# Altium project Nixie_Motherboard.PrjPcb
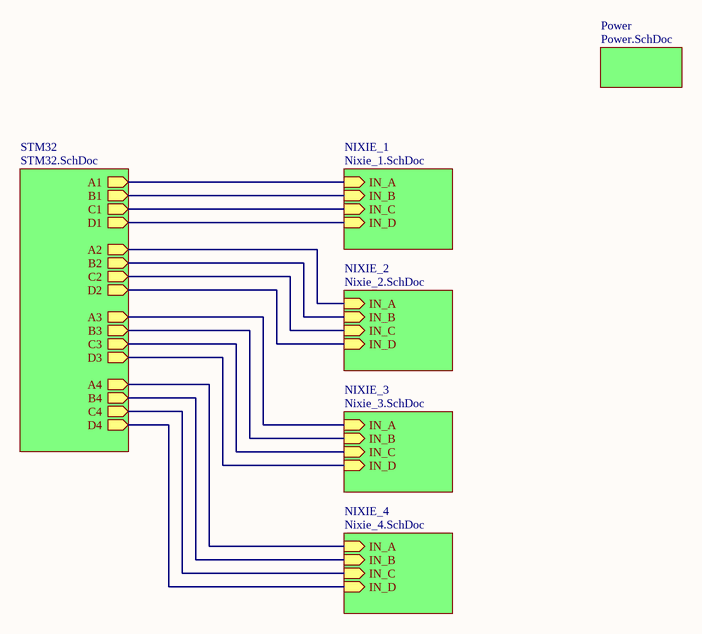
[diagram p0: Motherboard.SchDoc]
7 sheets, 74 parts. Net scope: hierarchical (ports join the sheet entries above them; power ports are global).
Board file: MotherBoard.PcbDoc
Sheets:
  Motherboard.SchDoc
    NIXIE_1 = Nixie_1.SchDoc
    NIXIE_2 = Nixie_2.SchDoc
    NIXIE_3 = Nixie_3.SchDoc
    NIXIE_4 = Nixie_4.SchDoc
    STM32 = STM32.SchDoc
    Power = Power.SchDoc

## Sheet Motherboard.SchDoc
size A4; SheetNumber: 1; SheetTotal: 7

### Sub-sheets
NIXIE_1 = Nixie_1.SchDoc: IN_A (in), IN_B (in), IN_C (in), IN_D (in)
NIXIE_2 = Nixie_2.SchDoc: IN_A (in), IN_B (in), IN_C (in), IN_D (in)
NIXIE_3 = Nixie_3.SchDoc: IN_A (in), IN_B (in), IN_C (in), IN_D (in)
NIXIE_4 = Nixie_4.SchDoc: IN_A (in), IN_B (in), IN_C (in), IN_D (in)
Power = Power.SchDoc: no entries
STM32 = STM32.SchDoc: A1 (out), B1 (out), C1 (out), D1 (out), A2 (out), B2 (out), C2 (out), D2 (out), A3 (out), B3 (out), C3 (out), D3 (out), A4 (out), B4 (out), C4 (out), D4 (out)

### Nets
NetQ1_1: sheet NIXIE_1/IN_A, sheet STM32/A1
NetQ1_4: sheet NIXIE_1/IN_B, sheet STM32/B1
NetQ2_1: sheet NIXIE_1/IN_C, sheet STM32/C1
NetQ2_4: sheet NIXIE_1/IN_D, sheet STM32/D1
NetQ3_1: sheet NIXIE_2/IN_A, sheet STM32/A2
NetQ3_4: sheet NIXIE_2/IN_B, sheet STM32/B2
NetQ4_1: sheet NIXIE_2/IN_C, sheet STM32/C2
NetQ4_4: sheet NIXIE_2/IN_D, sheet STM32/D2
NetQ5_1: sheet NIXIE_3/IN_A, sheet STM32/A3
NetQ5_4: sheet NIXIE_3/IN_B, sheet STM32/B3
NetQ6_1: sheet NIXIE_3/IN_C, sheet STM32/C3
NetQ6_4: sheet NIXIE_3/IN_D, sheet STM32/D3
NetQ7_1: sheet NIXIE_4/IN_A, sheet STM32/A4
NetQ7_4: sheet NIXIE_4/IN_B, sheet STM32/B4
NetQ8_1: sheet NIXIE_4/IN_C, sheet STM32/C4
NetQ8_4: sheet NIXIE_4/IN_D, sheet STM32/D4

## Sheet Nixie_1.SchDoc
size A4; SheetNumber: 4; SheetTotal: 7
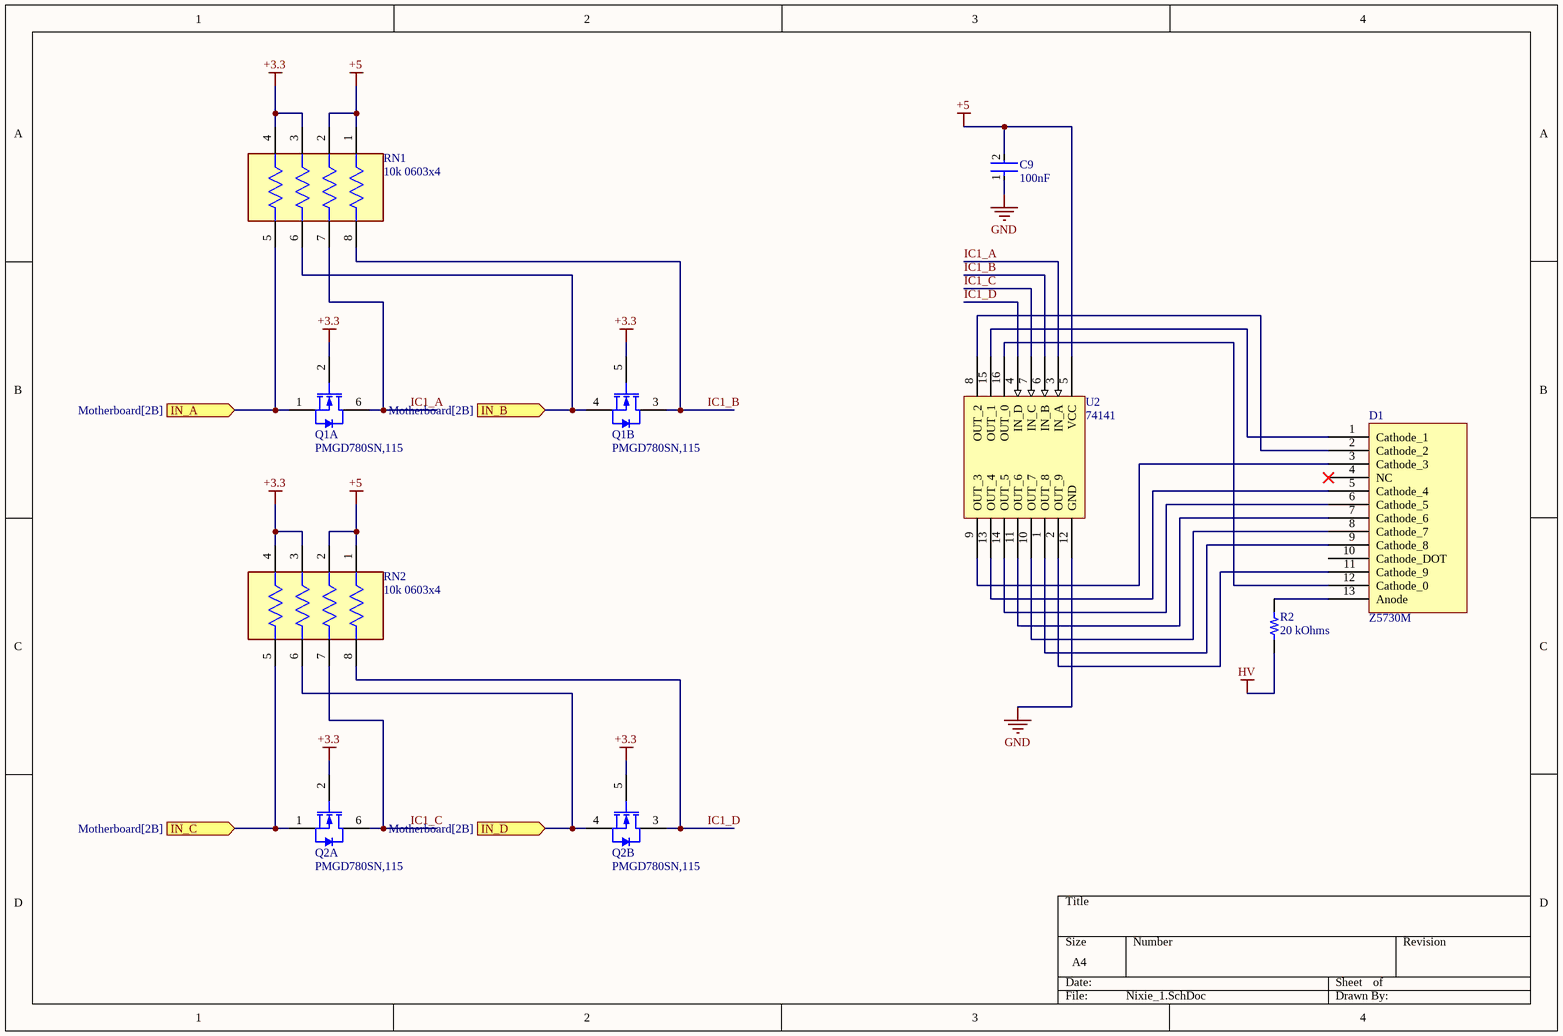
[diagram p1: Nixie_1.SchDoc]

### Parts
C9  100nF  [FP-C1005-050-0_15-MFG]
D1  Z5730M  [Z5730M]
Q1  PMGD780SN,115  [NXP-SOT363_N]  (parts A,B of 2)
Q2  PMGD780SN,115  [NXP-SOT363_N]  (parts A,B of 2)
R2  20 kOhms  [RES 1210_3225]
RN1  10k 0603x4  [FP-EXB38V-MFG]
RN2  10k 0603x4  [FP-EXB38V-MFG]
U2  74141  [DIP-16]

### Ports
IN_A (in, see Motherboard[2B]), IN_B (in, see Motherboard[2B]), IN_C (in, see Motherboard[2B]), IN_D (in, see Motherboard[2B])

### Nets
+3.3: Q1.2(G1) Q1.5(G2) Q2.2(G1) Q2.5(G2) RN1.3 RN1.4 RN2.3 RN2.4
+5: C9.2 RN1.1 RN1.2 RN2.1 RN2.2 U2.5(VCC)
GND: C9.1 U2.12(GND)
HV: R2.1
IC1_A: Q1.6(D1) RN1.7 U2.3(IN_A)
IC1_B: Q1.3(D2) RN1.8 U2.6(IN_B)
IC1_C: Q2.6(D1) RN2.7 U2.7(IN_C)
IC1_D: Q2.3(D2) RN2.8 U2.4(IN_D)
NetD1_1: D1.1(Cathode_1) U2.15(OUT_1)
NetD1_2: D1.2(Cathode_2) U2.8(OUT_2)
NetD1_3: D1.3(Cathode_3) U2.9(OUT_3)
NetD1_5: D1.5(Cathode_4) U2.13(OUT_4)
NetD1_6: D1.6(Cathode_5) U2.14(OUT_5)
NetD1_7: D1.7(Cathode_6) U2.11(OUT_6)
NetD1_8: D1.8(Cathode_7) U2.10(OUT_7)
NetD1_9: D1.9(Cathode_8) U2.1(OUT_8)
NetD1_11: D1.11(Cathode_9) U2.2(OUT_9)
NetD1_12: D1.12(Cathode_0) U2.16(OUT_0)
NetD1_13: D1.13(Anode) R2.2
NetQ1_1: Q1.1(S1) RN1.5 ; port IN_A
NetQ1_4: Q1.4(S2) RN1.6 ; port IN_B
NetQ2_1: Q2.1(S1) RN2.5 ; port IN_C
NetQ2_4: Q2.4(S2) RN2.6 ; port IN_D

Not connected (* = marked no-connect by the designer): D1 4(NC)* 10(Cathode_DOT)

### Library data of the parts
C9 = CMP-2000-05438-2: CAP CER 100nF 10V X5R 0402; Dielectric Material: Ceramic; Tolerance: 20%; Capacitance: 4.7uF
Q1 Q2 = CMP-1258-00177-1: Dual N-Channel uTrenchMOS Standard Level FET, 60 V, 0.49 A, 6-Pin SOT363, Tape and Reel; Manufacturer: NXP Semiconductors; ID [max] (A): 0.49; Packing: Tape & Reel; Channel Type: N; Coss [typ] (pF): 5; VDS [max] (V): 60; VGSth [typ] (V): 2; Ciss [typ] (pF): 23
R2 = CRCW121020K0FKEAHP: RES SMD 20K OHM 1% 3/4W 1210; Manufacturer: Vishay Dale; Power (Watts): 0.75W, 3/4W; Temperature Coefficient: ±100ppm/°C
RN1 RN2 = CMP-2000-05314-2: RES ARRAY 4 RES 10K OHM 1206 / RC-ML08W103JT; Number of Terminals/Pins: 8; Number of Elements: 4; Tolerance: 5%; Resistance: 10kR; Temperature Coefficient: 200ppm/°C; Power Per Element: 62.5mW; Voltage Rating (DC): 100V; Circuit Type: Isolated; Power Dissipation: 63mW; Voltage Rating: 50V

## Sheet Nixie_2.SchDoc
size A4; SheetNumber: 5; SheetTotal: 7
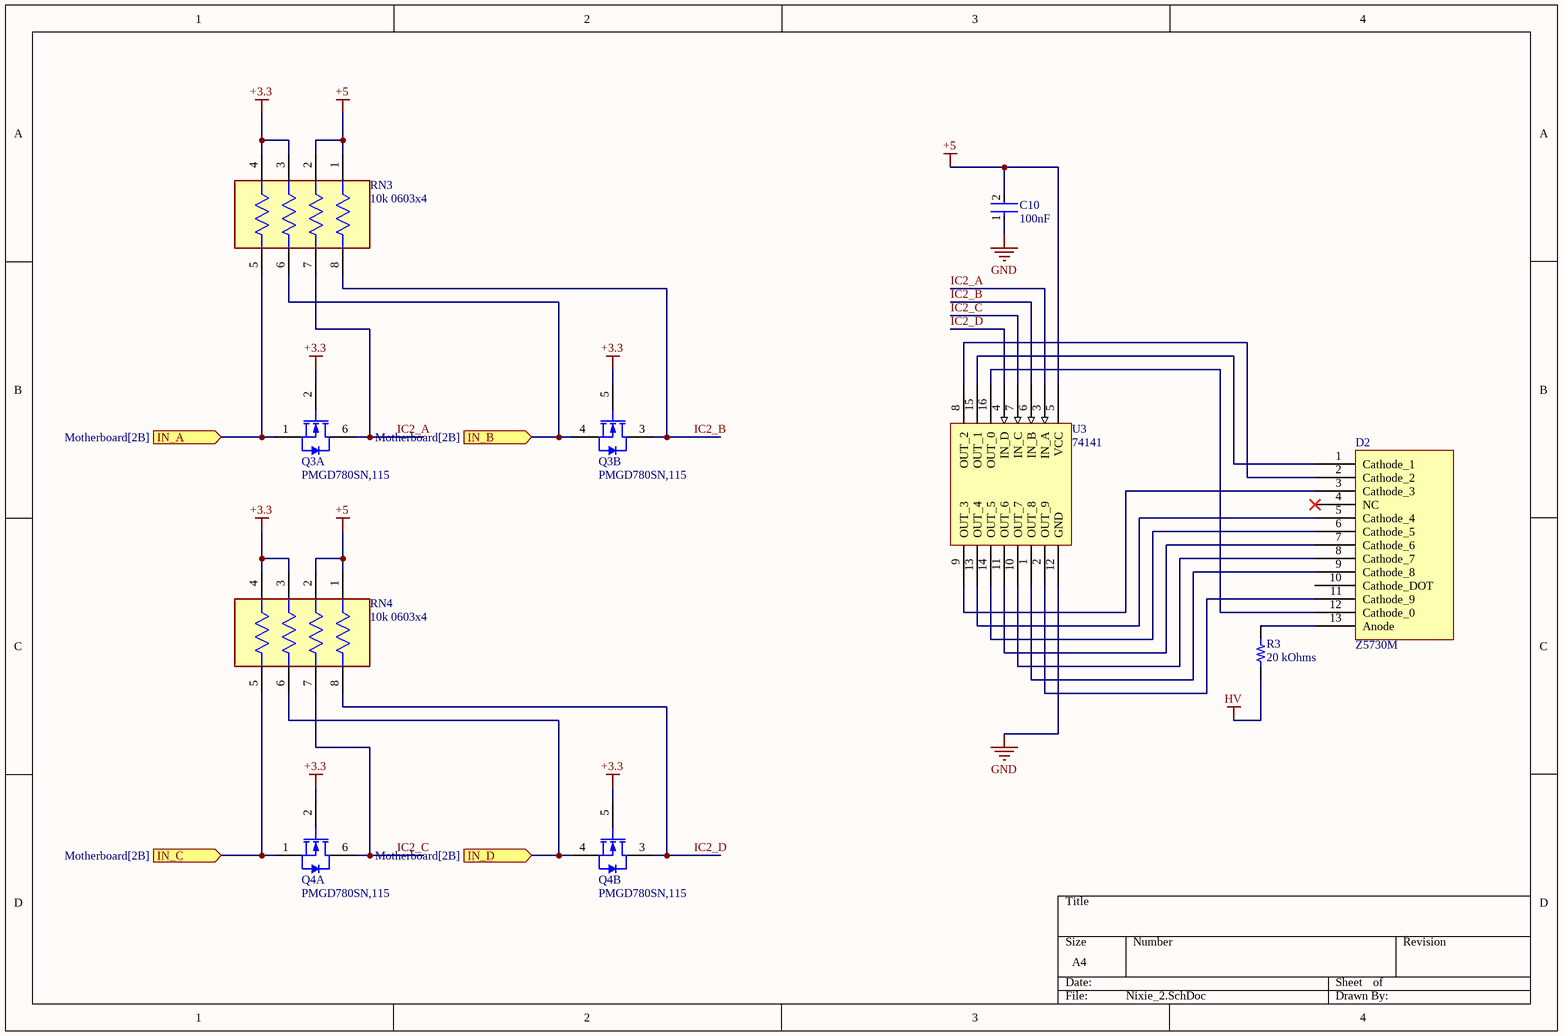
[diagram p2: Nixie_2.SchDoc]

### Parts
C10  100nF  [FP-C1005-050-0_15-MFG]
D2  Z5730M  [Z5730M]
Q3  PMGD780SN,115  [NXP-SOT363_N]  (parts A,B of 2)
Q4  PMGD780SN,115  [NXP-SOT363_N]  (parts A,B of 2)
R3  20 kOhms  [RES 1210_3225]
RN3  10k 0603x4  [FP-EXB38V-MFG]
RN4  10k 0603x4  [FP-EXB38V-MFG]
U3  74141  [DIP-16]

### Ports
IN_A (in, see Motherboard[2B]), IN_B (in, see Motherboard[2B]), IN_C (in, see Motherboard[2B]), IN_D (in, see Motherboard[2B])

### Nets
+3.3: Q3.2(G1) Q3.5(G2) Q4.2(G1) Q4.5(G2) RN3.3 RN3.4 RN4.3 RN4.4
+5: C10.2 RN3.1 RN3.2 RN4.1 RN4.2 U3.5(VCC)
GND: C10.1 U3.12(GND)
HV: R3.1
IC2_A: Q3.6(D1) RN3.7 U3.3(IN_A)
IC2_B: Q3.3(D2) RN3.8 U3.6(IN_B)
IC2_C: Q4.6(D1) RN4.7 U3.7(IN_C)
IC2_D: Q4.3(D2) RN4.8 U3.4(IN_D)
NetD2_1: D2.1(Cathode_1) U3.15(OUT_1)
NetD2_2: D2.2(Cathode_2) U3.8(OUT_2)
NetD2_3: D2.3(Cathode_3) U3.9(OUT_3)
NetD2_5: D2.5(Cathode_4) U3.13(OUT_4)
NetD2_6: D2.6(Cathode_5) U3.14(OUT_5)
NetD2_7: D2.7(Cathode_6) U3.11(OUT_6)
NetD2_8: D2.8(Cathode_7) U3.10(OUT_7)
NetD2_9: D2.9(Cathode_8) U3.1(OUT_8)
NetD2_11: D2.11(Cathode_9) U3.2(OUT_9)
NetD2_12: D2.12(Cathode_0) U3.16(OUT_0)
NetD2_13: D2.13(Anode) R3.2
NetQ3_1: Q3.1(S1) RN3.5 ; port IN_A
NetQ3_4: Q3.4(S2) RN3.6 ; port IN_B
NetQ4_1: Q4.1(S1) RN4.5 ; port IN_C
NetQ4_4: Q4.4(S2) RN4.6 ; port IN_D

Not connected (* = marked no-connect by the designer): D2 4(NC)* 10(Cathode_DOT)

### Library data of the parts
C10 = CMP-2000-05438-2: as C9 on sheet Nixie_1
Q3 Q4 = CMP-1258-00177-1: as Q1 on sheet Nixie_1
R3 = CRCW121020K0FKEAHP: as R2 on sheet Nixie_1
RN3 RN4 = CMP-2000-05314-2: as RN1 on sheet Nixie_1

## Sheet Nixie_3.SchDoc
size A4; SheetNumber: 6; SheetTotal: 7
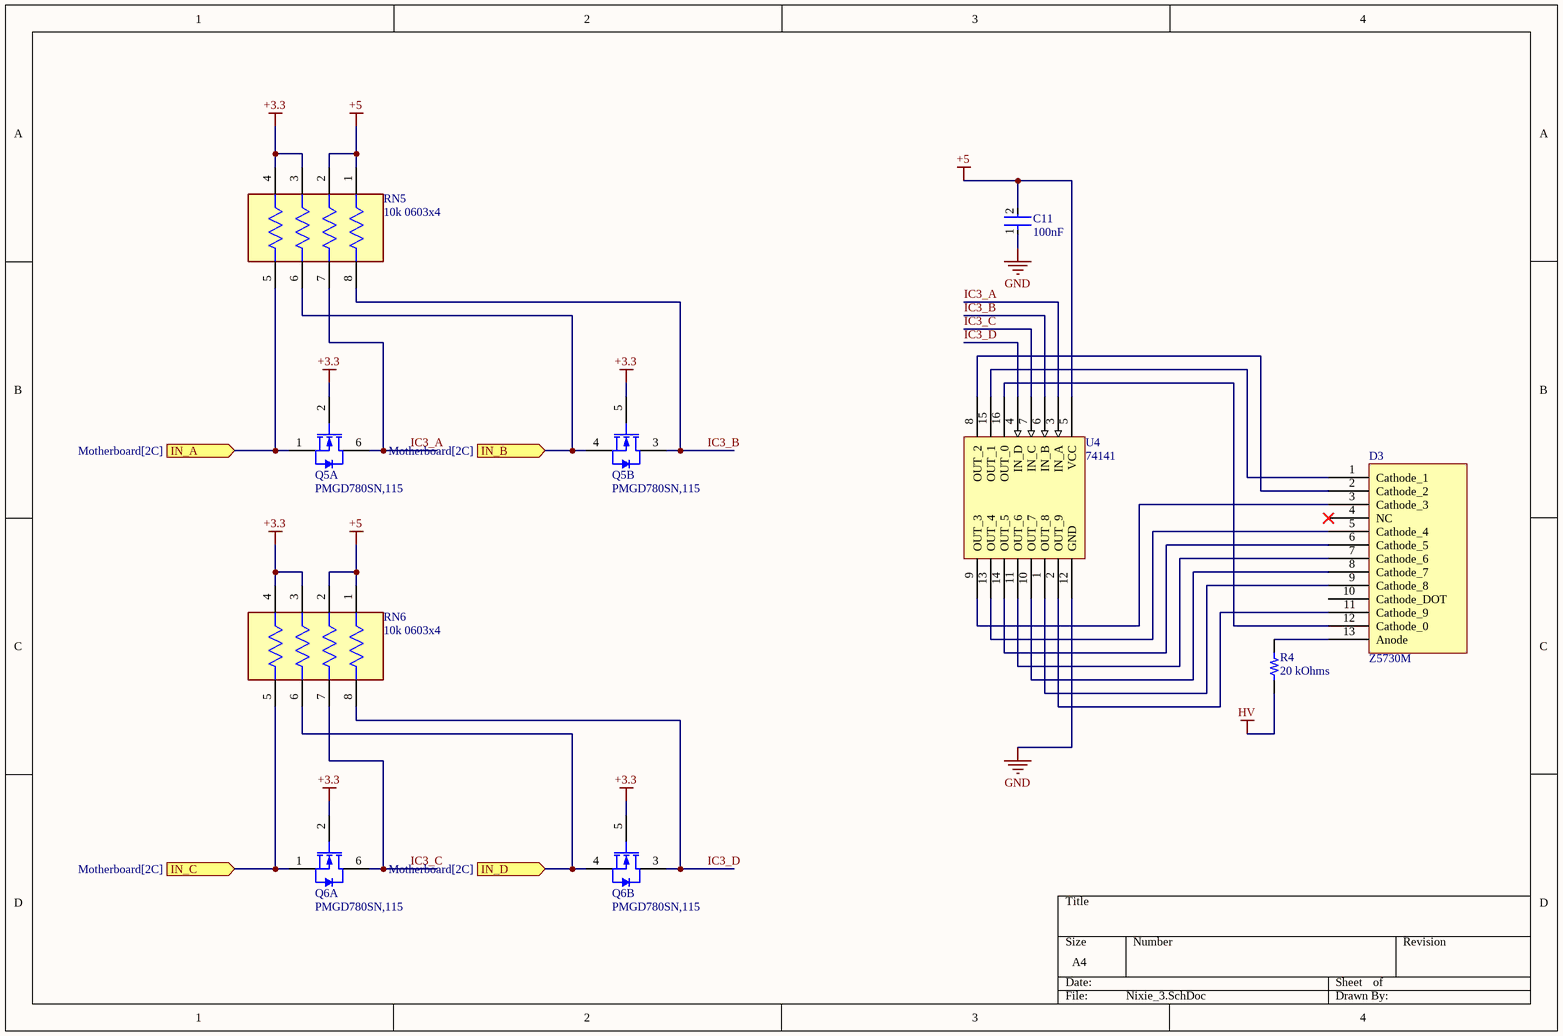
[diagram p3: Nixie_3.SchDoc]

### Parts
C11  100nF  [FP-C1005-050-0_15-MFG]
D3  Z5730M  [Z5730M]
Q5  PMGD780SN,115  [NXP-SOT363_N]  (parts A,B of 2)
Q6  PMGD780SN,115  [NXP-SOT363_N]  (parts A,B of 2)
R4  20 kOhms  [RES 1210_3225]
RN5  10k 0603x4  [FP-EXB38V-MFG]
RN6  10k 0603x4  [FP-EXB38V-MFG]
U4  74141  [DIP-16]

### Ports
IN_A (in, see Motherboard[2C]), IN_B (in, see Motherboard[2C]), IN_C (in, see Motherboard[2C]), IN_D (in, see Motherboard[2C])

### Nets
+3.3: Q5.2(G1) Q5.5(G2) Q6.2(G1) Q6.5(G2) RN5.3 RN5.4 RN6.3 RN6.4
+5: C11.2 RN5.1 RN5.2 RN6.1 RN6.2 U4.5(VCC)
GND: C11.1 U4.12(GND)
HV: R4.1
IC3_A: Q5.6(D1) RN5.7 U4.3(IN_A)
IC3_B: Q5.3(D2) RN5.8 U4.6(IN_B)
IC3_C: Q6.6(D1) RN6.7 U4.7(IN_C)
IC3_D: Q6.3(D2) RN6.8 U4.4(IN_D)
NetD3_1: D3.1(Cathode_1) U4.15(OUT_1)
NetD3_2: D3.2(Cathode_2) U4.8(OUT_2)
NetD3_3: D3.3(Cathode_3) U4.9(OUT_3)
NetD3_5: D3.5(Cathode_4) U4.13(OUT_4)
NetD3_6: D3.6(Cathode_5) U4.14(OUT_5)
NetD3_7: D3.7(Cathode_6) U4.11(OUT_6)
NetD3_8: D3.8(Cathode_7) U4.10(OUT_7)
NetD3_9: D3.9(Cathode_8) U4.1(OUT_8)
NetD3_11: D3.11(Cathode_9) U4.2(OUT_9)
NetD3_12: D3.12(Cathode_0) U4.16(OUT_0)
NetD3_13: D3.13(Anode) R4.2
NetQ5_1: Q5.1(S1) RN5.5 ; port IN_A
NetQ5_4: Q5.4(S2) RN5.6 ; port IN_B
NetQ6_1: Q6.1(S1) RN6.5 ; port IN_C
NetQ6_4: Q6.4(S2) RN6.6 ; port IN_D

Not connected (* = marked no-connect by the designer): D3 4(NC)* 10(Cathode_DOT)

### Library data of the parts
C11 = CMP-2000-05438-2: as C9 on sheet Nixie_1
Q5 Q6 = CMP-1258-00177-1: as Q1 on sheet Nixie_1
R4 = CRCW121020K0FKEAHP: as R2 on sheet Nixie_1
RN5 RN6 = CMP-2000-05314-2: as RN1 on sheet Nixie_1

## Sheet Nixie_4.SchDoc
size A4; SheetNumber: 7; SheetTotal: 7
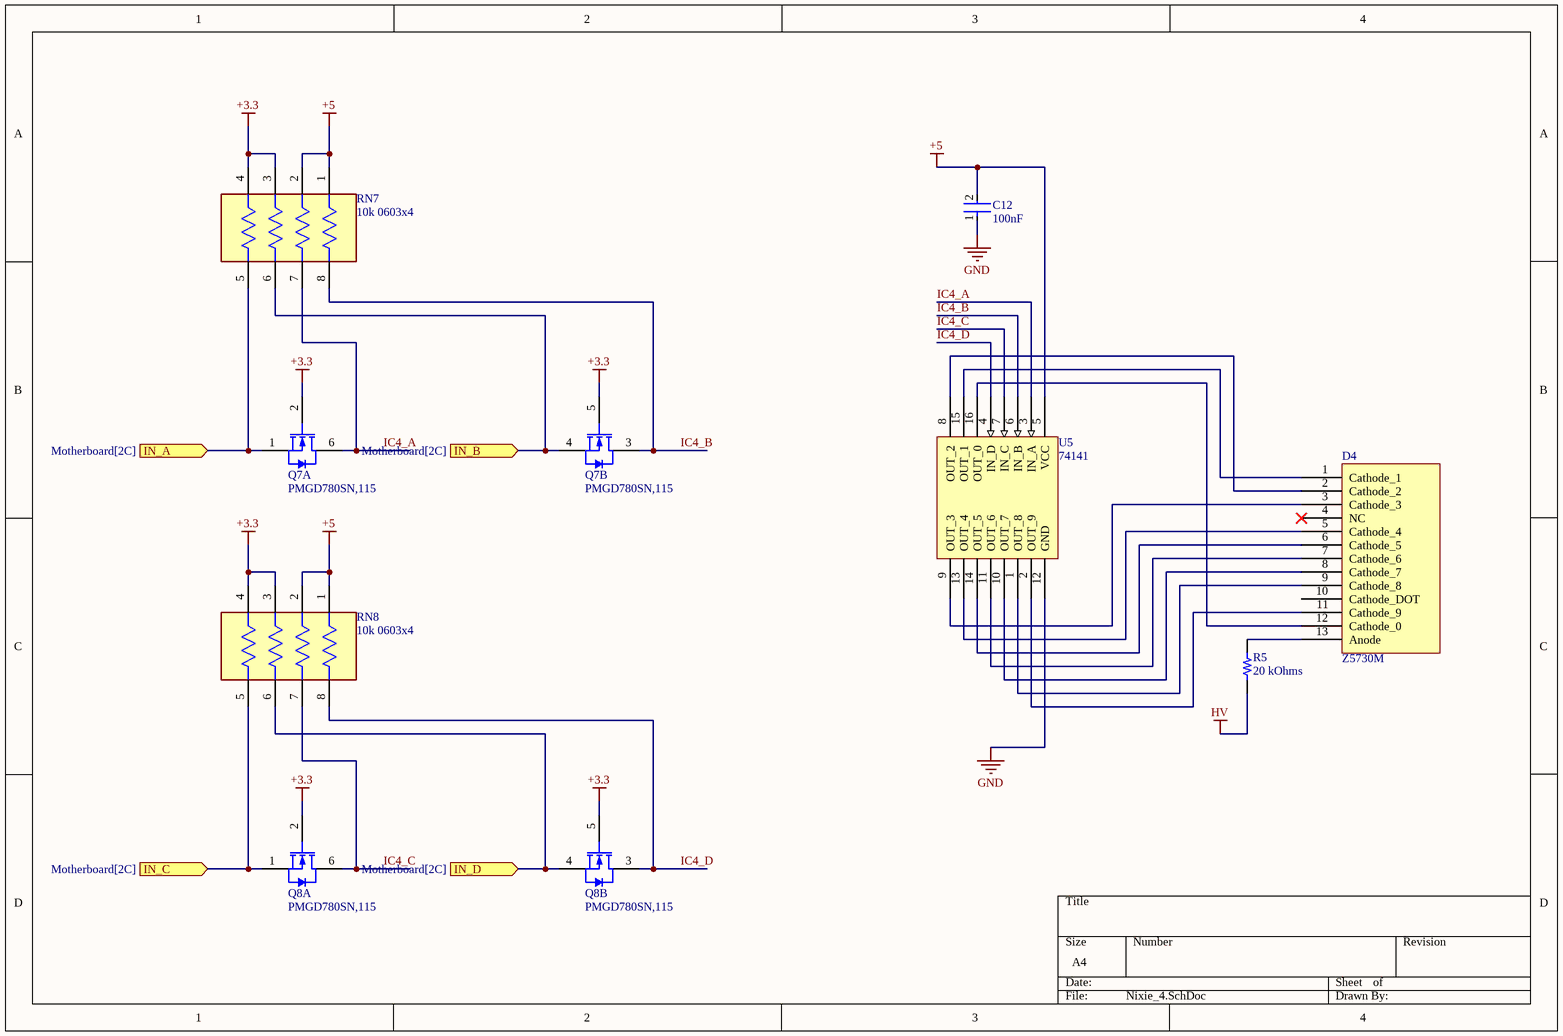
[diagram p4: Nixie_4.SchDoc]

### Parts
C12  100nF  [FP-C1005-050-0_15-MFG]
D4  Z5730M  [Z5730M]
Q7  PMGD780SN,115  [NXP-SOT363_N]  (parts A,B of 2)
Q8  PMGD780SN,115  [NXP-SOT363_N]  (parts A,B of 2)
R5  20 kOhms  [RES 1210_3225]
RN7  10k 0603x4  [FP-EXB38V-MFG]
RN8  10k 0603x4  [FP-EXB38V-MFG]
U5  74141  [DIP-16]

### Ports
IN_A (in, see Motherboard[2C]), IN_B (in, see Motherboard[2C]), IN_C (in, see Motherboard[2C]), IN_D (in, see Motherboard[2C])

### Nets
+3.3: Q7.2(G1) Q7.5(G2) Q8.2(G1) Q8.5(G2) RN7.3 RN7.4 RN8.3 RN8.4
+5: C12.2 RN7.1 RN7.2 RN8.1 RN8.2 U5.5(VCC)
GND: C12.1 U5.12(GND)
HV: R5.1
IC4_A: Q7.6(D1) RN7.7 U5.3(IN_A)
IC4_B: Q7.3(D2) RN7.8 U5.6(IN_B)
IC4_C: Q8.6(D1) RN8.7 U5.7(IN_C)
IC4_D: Q8.3(D2) RN8.8 U5.4(IN_D)
NetD4_1: D4.1(Cathode_1) U5.15(OUT_1)
NetD4_2: D4.2(Cathode_2) U5.8(OUT_2)
NetD4_3: D4.3(Cathode_3) U5.9(OUT_3)
NetD4_5: D4.5(Cathode_4) U5.13(OUT_4)
NetD4_6: D4.6(Cathode_5) U5.14(OUT_5)
NetD4_7: D4.7(Cathode_6) U5.11(OUT_6)
NetD4_8: D4.8(Cathode_7) U5.10(OUT_7)
NetD4_9: D4.9(Cathode_8) U5.1(OUT_8)
NetD4_11: D4.11(Cathode_9) U5.2(OUT_9)
NetD4_12: D4.12(Cathode_0) U5.16(OUT_0)
NetD4_13: D4.13(Anode) R5.2
NetQ7_1: Q7.1(S1) RN7.5 ; port IN_A
NetQ7_4: Q7.4(S2) RN7.6 ; port IN_B
NetQ8_1: Q8.1(S1) RN8.5 ; port IN_C
NetQ8_4: Q8.4(S2) RN8.6 ; port IN_D

Not connected (* = marked no-connect by the designer): D4 4(NC)* 10(Cathode_DOT)

### Library data of the parts
C12 = CMP-2000-05438-2: as C9 on sheet Nixie_1
Q7 Q8 = CMP-1258-00177-1: as Q1 on sheet Nixie_1
R5 = CRCW121020K0FKEAHP: as R2 on sheet Nixie_1
RN7 RN8 = CMP-2000-05314-2: as RN1 on sheet Nixie_1

## Sheet STM32.SchDoc
size A4; SheetNumber: 2; SheetTotal: 7
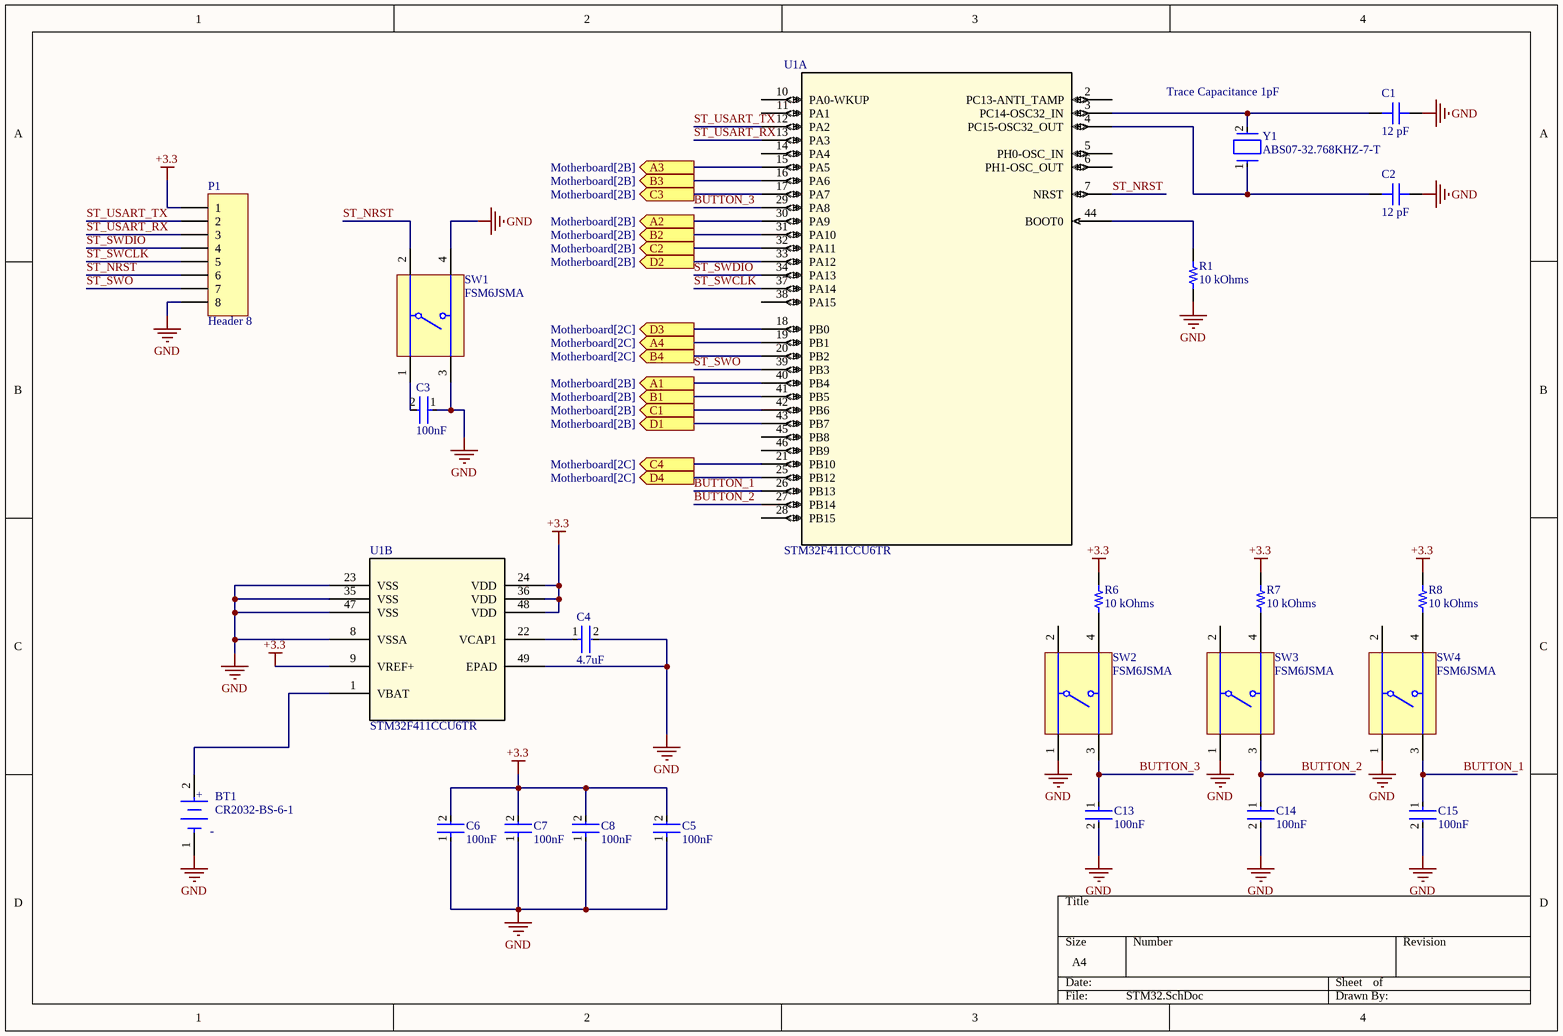
[diagram p5: STM32.SchDoc]

### Parts
BT1  CR2032-BS-6-1  [FP-BU2032SM-BT-GTR-MFG]
C1  12 pF  [CAP 0201_0603]
C2  12 pF  [CAP 0201_0603]
C3  100nF  [FP-C1005-050-0_15-MFG]
C4  4.7uF  [FP-C1005-050-0_15-MFG]
C5  100nF  [FP-C1005-050-0_15-MFG]
C6  100nF  [FP-C1005-050-0_15-MFG]
C7  100nF  [FP-C1005-050-0_15-MFG]
C8  100nF  [FP-C1005-050-0_15-MFG]
C13  100nF  [FP-C1005-050-0_15-MFG]
C14  100nF  [FP-C1005-050-0_15-MFG]
C15  100nF  [FP-C1005-050-0_15-MFG]
P1  Header 8  [HDR1X8]
R1  10 kOhms  [RES 0402_1005]
R6  10 kOhms  [RES 0402_1005]
R7  10 kOhms  [RES 0402_1005]
R8  10 kOhms  [RES 0402_1005]
SW1  FSM6JSMA  [TECO-FSM6JSMA_V]
SW2  FSM6JSMA  [TECO-FSM6JSMA_V]
SW3  FSM6JSMA  [TECO-FSM6JSMA_V]
SW4  FSM6JSMA  [TECO-FSM6JSMA_V]
U1  STM32F411CCU6TR  [UFQFPN-48_7X7X0P55MM]  (parts A,B of 2)
Y1  ABS07-32.768KHZ-7-T  [FP-ABS07-MFG]

### Ports
A1 (out, see Motherboard[2B]), A2 (out, see Motherboard[2B]), A3 (out, see Motherboard[2B]), A4 (out, see Motherboard[2C]), B1 (out, see Motherboard[2B]), B2 (out, see Motherboard[2B]), B3 (out, see Motherboard[2B]), B4 (out, see Motherboard[2C]), C1 (out, see Motherboard[2B]), C2 (out, see Motherboard[2B]), C3 (out, see Motherboard[2B]), C4 (out, see Motherboard[2C]), D1 (out, see Motherboard[2B]), D2 (out, see Motherboard[2B]), D3 (out, see Motherboard[2C]), D4 (out, see Motherboard[2C])

### Nets
+3.3: C5.2 C6.2 C7.2 C8.2 P1.1 R6.2 R7.2 R8.2 U1.9(VREF+) U1.24(VDD) U1.36(VDD) U1.48(VDD)
GND: BT1.1(C) C1.2 C2.2 C3.1 C4.2 C5.1 C6.1 C7.1 C8.1 C13.2 C14.2 C15.2 P1.8 R1.1 SW1.3 SW1.4 SW2.1 SW3.1 SW4.1 U1.8(VSSA) U1.23(VSS) U1.35(VSS) U1.47(VSS) U1.49(EPAD)
BUTTON_1: C15.1 SW4.3 U1.26(PB13)
BUTTON_2: C14.1 SW3.3 U1.27(PB14)
BUTTON_3: C13.1 SW2.3 U1.29(PA8)
ST_NRST: P1.6 SW1.2 U1.7(NRST)
ST_SWCLK: P1.5 U1.37(PA14)
ST_SWDIO: P1.4 U1.34(PA13)
ST_SWO: P1.7 U1.39(PB3)
ST_USART_RX: P1.3 U1.13(PA3)
ST_USART_TX: P1.2 U1.12(PA2)
NetBT1_2: BT1.2(A) U1.1(VBAT)
NetC1_1: C1.1 U1.3(PC14-OSC32_IN) Y1.2
NetC2_1: C2.1 U1.4(PC15-OSC32_OUT) Y1.1
NetC3_2: C3.2 SW1.1
NetC4_1: C4.1 U1.22(VCAP1)
NetQ1_1: U1.40(PB4) ; port A1
NetQ1_4: U1.41(PB5) ; port B1
NetQ2_1: U1.42(PB6) ; port C1
NetQ2_4: U1.43(PB7) ; port D1
NetQ3_1: U1.30(PA9) ; port A2
NetQ3_4: U1.31(PA10) ; port B2
NetQ4_1: U1.32(PA11) ; port C2
NetQ4_4: U1.33(PA12) ; port D2
NetQ5_1: U1.15(PA5) ; port A3
NetQ5_4: U1.16(PA6) ; port B3
NetQ6_1: U1.17(PA7) ; port C3
NetQ6_4: U1.18(PB0) ; port D3
NetQ7_1: U1.19(PB1) ; port A4
NetQ7_4: U1.20(PB2) ; port B4
NetQ8_1: U1.21(PB10) ; port C4
NetQ8_4: U1.25(PB12) ; port D4
NetR1_2: R1.2 U1.44(BOOT0)
NetR6_1: R6.1 SW2.4
NetR7_1: R7.1 SW3.4
NetR8_1: R8.1 SW4.4

Not connected (* = marked no-connect by the designer): SW2 2; SW3 2; SW4 2; U1 2(PC13-ANTI_TAMP) 5(PH0-OSC_IN) 6(PH1-OSC_OUT) 10(PA0-WKUP) 11(PA1) 14(PA4) 28(PB15) 38(PA15) 45(PB8) 46(PB9)

### Notes on the sheet
- (near Y1) Trace Capacitance 1pF
- (in symbol CMP-136216-000002-1) +; -

### Library data of the parts
BT1 = CMP-136216-000002-1: Number of Cells: 1; Termination: SMD/SMT; Mount: Surface Mount; Max Operating Temperature: 280°C; Min Operating Temperature: -40°C; Package Quantity: 400; Case/Package: SMD/SMT
C1 C2 = C0201C100J3GAC7867: CAP CER 10PF 25V C0G/NP0 0201; manufacturer: KEMET; Temperature Coefficient: C0G, NP0; Tolerance: ±5%; Part Number: C0201C100J3GAC7867; Value: 12 pF; Applications: General Purpose; Capacitance: 12 pF; componentlink1description: Datasheet; componentlink1url: https://api.kemet.com/component-edge/download/datasheet/C0201C100J3GAC7867.pdf; componentlink2description: DigiKey Link; componentlink2url: https://www.digikey.com/en/products/detail/kemet/C0201C100J3GAC7867/7381972; Device Package: 0201 (0603 Metric); Features: Low ESL; lastupdated: 13.03.2023 19:01:22; Lifecycle Status: Active; Minimum Order: 1; Mounting Type: Surface Mount, MLCC; Operating Temperature: -55°C ~ 125°C; Package / Case: 0201 (0603 Metric); packaging: TapeAndReel; partid: 4; Part Status: Active; price: 0.02; series: SMD Comm C0G; Size / Dimension: 0.024" L x 0.012" W (0.60mm x 0.30mm); Supplier 1: DigiKey; Supplier Part Number 1: 399-14856-1-ND; Thickness (Max): 0.013" (0.33mm); Voltage - Rated: 25V
C3 C5-C8 C13-C15 = CMP-2000-05438-2: as C9 on sheet Nixie_1; RoHS Compliant: Yes; Lead Free: Lead Free; Max Operating Temperature: 85°C; Case Code (Metric): 1005; Dielectric: X5R; Height: 0.5mm; Length: 1mm; Case Code (Imperial): 0402; Width: 0.02inch; Mount: Surface Mount; Case/Package: 0402; Min Operating Temperature: -55°C; Radiation Hardening: No; Resistor Type: Ceramic; Construction: Flat; REACH SVHC: No SVHC; Voltage Rating (DC): 10V; Voltage Rating: 10V; Package Quantity: 1; Termination: SMD/SMT; Thickness: 500um; Voltage: 10V; Packaging: Tape and Reel; Depth: 0.5mm; Weight: 2.3E-05oz; Series: C
C4 = CMP-2000-05438-2: CAP CER 4.7UF 10V X5R 0402; Dielectric Material: Ceramic; Tolerance: 20%; RoHS Compliant: Yes; Lead Free: Lead Free; Max Operating Temperature: 85°C; Case Code (Metric): 1005; Dielectric: X5R; Height: 0.5mm; Length: 1mm; Case Code (Imperial): 0402; Width: 0.02inch; Mount: Surface Mount; Case/Package: 0402; Min Operating Temperature: -55°C; Radiation Hardening: No; Resistor Type: Ceramic; Construction: Flat; REACH SVHC: No SVHC; Voltage Rating (DC): 10V; Voltage Rating: 10V; Package Quantity: 1; Termination: SMD/SMT; Thickness: 500um; Capacitance: 4.7uF; Voltage: 10V; Packaging: Tape and Reel; Depth: 0.5mm; Weight: 2.3E-05oz; Series: C
P1 = Header 8: Header, 8-Pin; LatestRevisionDate: 17-Jul-2002; LatestRevisionNote: Re-released for DXP Platform.; Publisher: Altium Limited
R1 R6-R8 = TNPW040210K0BETD: RES 10K OHM 1% 1/16W 0402; Manufacturer: Vishay Dale; Power (Watts): 0.063W, 1/16W; Temperature Coefficient: ±25ppm/°C; Tolerance: ±0.1%; Part Number: TNPW040210K0BETD; Value: 10 kOhms; ComponentLink1Description: Datasheet; ComponentLink1URL: http://www.vishay.com/docs/31006/tnpw.pdf; ComponentLink2Description: DigiKey Link; ComponentLink2URL: https://www.digikey.com/en/products/detail/vishay-dale/TNPW040210K0BETD/1613222; Composition: Thin Film; Device Package: 0402 (1005 Metric); Features: Military; Height - Seated (Max): 0.016" (0.40mm); LastUpdated: 13.03.2023 19:23:30; Lifecycle Status: Active; Minimum Order: 1; Number of Terminations: 2; Operating Temperature: -55°C ~ 125°C; Package / Case: 0402 (1005 Metric); Packaging: TapeAndReel; PartId: 3021; Part Status: Active; Price: 0.25; Resistance: 10 kOhms; Series: TNPW; Size / Dimension: 0.039" L x 0.020" W (1.00mm x 0.50mm); Supplier 1: DigiKey; Supplier Part Number 1: 541-3559-1-ND; Supplier Device Package: 0402
SW1-SW4 = CMP-2000-07503-1: Switch, SPST, 24 V, -35 to 85 degC, 4-Pin SMD, RoHS, Tape and Reel; Manufacturer: TE Connectivity; Electrical Life: 100000Cycles; Voltage Rating (DC): 24V; Contact Resistance: 100mOhm; Case\/Package: SMD/SMT; Actuator Length: 3.4mm; Contact Current Rating: 50mA; Operating Force: 1.57N; Max Voltage Rating (DC): 12V; Illumination Type: Illuminated; Actuator Material: Polyamide; Switch Travel: 0.25mm; Contact Plating: Silver; Mount: SurfaceMount; Contact Material: CopperAlloy; RoHSCompliant: true; Width: 6mm; Package Reference: FSM6JSMA; Manufacturer URL: http://www.te.com/; Min Operating Temperature: -35degC; REACH SVHC: Unknown; Datasheet Version: Rev. V, 02/2015; Package Quantity: 750; Voltage Rating: 24V; Termination: GullWing; Mechanical Life: 100000Cycles; Mounting Technology: SurfaceMount; Insulation Resistance: 100MOhm; Packaging: LoosePiece; Package Description: 4-Pin Surface Mount Device, Body 6 x 6 mm, Pitch 4.5 mm; Orientation: Straight; Max Operating Temperature: 85degC; Length: 6mm; Current Rating: 50mA; Datasheet URL: http://www.te.com/commerce/DocumentDelivery/DDEController?Action=showdoc&DocId=Customer+Drawing%7F2-1437565-7%7FV%7Fpdf%7FEnglish%7FENG_CD_2-1437565-7_V.pdf%7F4-1437565-9; Lead Free: LeadFree; ELV: Compliant; Throw Configuration: SPST
U1 = STM32F411CCU6TR: No Description Available; Mfr_Name: STMicroelectronics; Copyright: Copyright (C) 2023 Ultra Librarian. All rights reserved.; Manufacturer_Part_Number: STM32F411CCU6TR; RefDes: RefDes; Type: DEV
Y1 = CMP-27762-013661-2: Crystal 32.768kHz ±20ppm (Tol) 9pF FUND 70kΩ 2-Pin CSMD T/R; Insulation Resistance: 500MR; Series Resistance: 70kR; Packaging: Tape and Reel; Length: 3.2mm; Max Operating Temperature: 85°C; Mount: Surface Mount; Height: 0.9mm; Number of Pins: 2; Depth: 1.5mm; Series: ABS07; REACH SVHC: No SVHC; Tolerance: 20ppm; Radiation Hardening: No; Case/Package: CSMD; Package Quantity: 3000; Termination: SMD/SMT; Operating Frequency: 32.768 kHz; Width: 1.5mm; Load Capacitance: 9pF; Lead Free: Lead Free; Frequency Tolerance: 20ppm; Frequency Stability: 20ppm; Frequency: 32.768kHz; ESR (Equivalent Series Resistance): 70kR; RoHS Compliant: Yes; Min Operating Temperature: -40°C

## Sheet Power.SchDoc
size A4; SheetNumber: 3; SheetTotal: 7
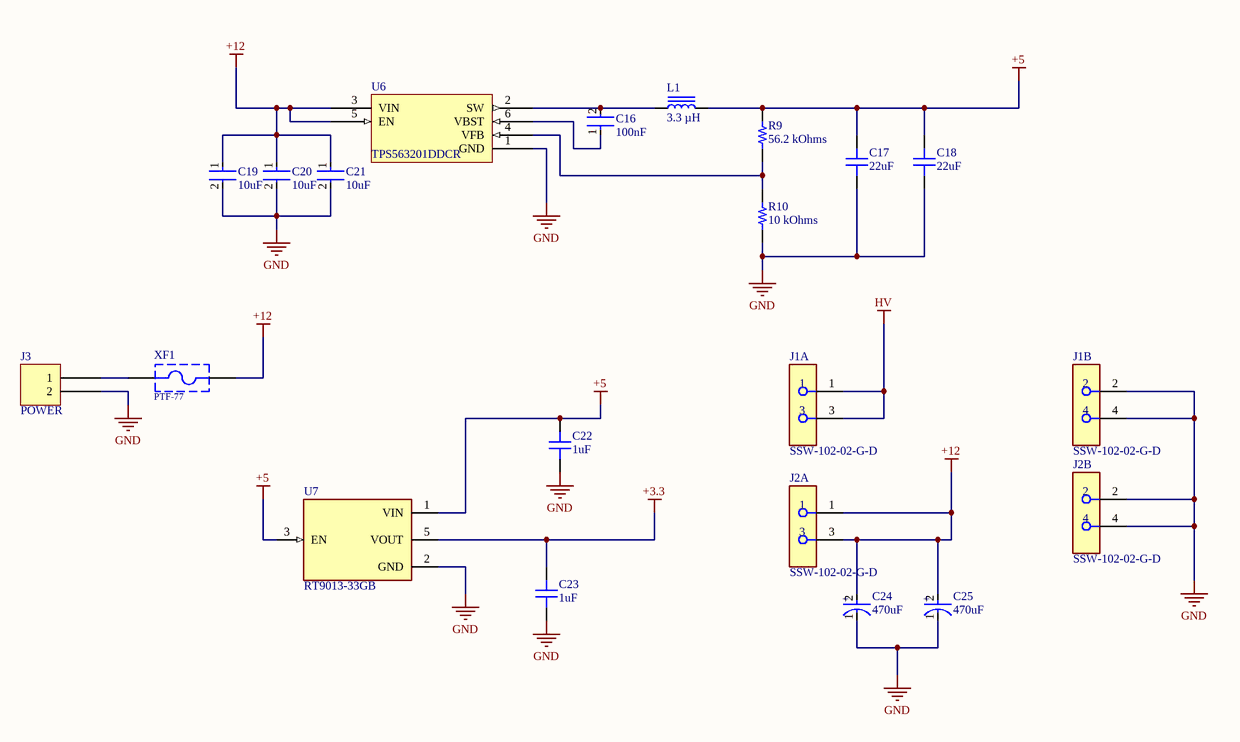
[diagram p6: Power.SchDoc]

### Parts
C16  100nF  [FP-C1005-050-0_15-MFG]
C17  22uF  [CAP 0603_1608]
C18  22uF  [CAP 0603_1608]
C19  10uF  [FP-CL21-IPC_B]
C20  10uF  [FP-CL21-IPC_B]
C21  10uF  [FP-CL21-IPC_B]
C22  1uF  [CAP 0603_1608]
C23  1uF  [CAP 0603_1608]
C24  470uF  [FP-RAD-TH-D_8_0_5-L_15_1-MFG]
C25  470uF  [FP-RAD-TH-D_8_0_5-L_15_1-MFG]
J1  SSW-102-02-G-D  [FP-SSW-102-02-G-D-MFG]  (parts A,B of 2)
J2  SSW-102-02-G-D  [FP-SSW-102-02-G-D-MFG]  (parts A,B of 2)
J3  POWER  [MOLEX KK 0022272021]
L1  3.3 µH  [BOURNS SRP5030T]
R9  56.2 kOhms  [RES 0402_1005]
R10  10 kOhms  [RES 0402_1005]
U6  TPS563201DDCR  [SOT23-6_M]
U7  RT9013-33GB  [RT9013]
XF1  PTF-77  [696107003002]

### Nets
+3.3: C23.2 U7.5(VOUT)
+5: C17.2 C18.2 C22.2 L1.2 R9.2 U7.1(VIN) U7.3(EN)
+12: C19.1 C20.1 C21.1 C24.2(A) C25.2(A) J2.1 J2.3 U6.3(VIN) U6.5(EN) XF1.2
GND: C17.1 C18.1 C19.2 C20.2 C21.2 C22.1 C23.1 C24.1(C) C25.1(C) J1.2 J1.4 J2.2 J2.4 J3.2 R10.1 U6.1(GND) U7.2(GND)
HV: J1.1 J1.3
NetC16_1: C16.1 U6.6(VBST)
NetC16_2: C16.2 L1.1 U6.2(SW)
NetJ3_1: J3.1 XF1.1
NetR9_1: R9.1 R10.2 U6.4(VFB)

### Notes on the sheet
- (in symbol CMP-05427-000701-1) +

### Library data of the parts
C16 = CMP-2000-05438-2: as C9 on sheet Nixie_1; RoHS Compliant: Yes; Lead Free: Lead Free; Max Operating Temperature: 85°C; Case Code (Metric): 1005; Dielectric: X5R; Height: 0.5mm; Length: 1mm; Case Code (Imperial): 0402; Width: 0.02inch; Mount: Surface Mount; Case/Package: 0402; Min Operating Temperature: -55°C; Radiation Hardening: No; Resistor Type: Ceramic; Construction: Flat; REACH SVHC: No SVHC; Voltage Rating (DC): 10V; Voltage Rating: 10V; Package Quantity: 1; Termination: SMD/SMT; Thickness: 500um; Voltage: 10V; Packaging: Tape and Reel; Depth: 0.5mm; Weight: 2.3E-05oz; Series: C
C17 C18 C22 C23 = C0603C272F3GAC7867: CL10A226MP8NUNE; manufacturer: KEMET; Temperature Coefficient: C0G, NP0; Tolerance: ±1%; Voltage - Rated: 25V; Part Number: C0603C272F3GAC7867; Applications: General Purpose; componentlink1description: Datasheet; componentlink1url: https://api.kemet.com/component-edge/download/datasheet/C0603C272F3GACTU.pdf; componentlink2description: DigiKey Link; componentlink2url: https://www.digikey.com/en/products/detail/kemet/C0603C272F3GAC7867/2200413; Device Package: 0603 (1608 Metric); Features: Low ESL; lastupdated: 22.03.2023 19:09:03; Lifecycle Status: Active; Minimum Order: 1; Mounting Type: Surface Mount, MLCC; Operating Temperature: -55°C ~ 125°C; Package / Case: 0603 (1608 Metric); packaging: TapeAndReel; partid: 2138; Part Status: Active; price: 0.42; series: SMD Comm C0G; Size / Dimension: 0.063" L x 0.031" W (1.60mm x 0.80mm); Supplier 1: DigiKey; Supplier Part Number 1: 399-17403-1-ND; Thickness (Max): 0.034" (0.87mm)
  C17 C18: Value: 22uF; Capacitance: 22uF
  C22 C23: Value: 1uF; Capacitance: 1uF
C19-C21 = CMP-2000-06102-2: CL21 Series 0805 10uF 16V ±10% Tolerance X5R Multilayer Ceramic Chip Capacitor; Dielectric: X7R; Length: 2mm; Depth: 1.25mm; Voltage: 16V; Width: 0.049inch; Capacitance: 10uF; Lead Free: Lead Free; Max Operating Temperature: 85°C; Mount: Surface Mount; Voltage Rating: 16V; Height: 1.25mm; Radiation Hardening: No; Packaging: Tape and Reel; Voltage Rating (DC): 16V; Thickness: 0.055inch; Case/Package: 0805; Case Code (Imperial): 0805; Min Operating Temperature: -55°C; Case Code (Metric): 2012; Package Quantity: 1; Tolerance: 10%
C24 C25 = CMP-05427-000701-1: EEUFM1C471L; Ripple Current: 1.14A; Lead Diameter: 0.6mm; Voltage Rating: 50V; Polarity: Polar; ESR (Equivalent Series Resistance): 45mR; Life (Hours): 8000Hour; Tolerance: 20%; RoHS Compliant: Yes; Min Operating Temperature: -40°C; Diameter: 8mm; Package Quantity: 1; Capacitance: 470uF; Packaging: Tape and Reel; Mount: Through Hole; Lead Free: Lead Free; Lead Pitch: 5mm; Height - Seated (Max): 0.65inch; Radiation Hardening: No; Features: General Purpose; Length: 15mm; Height: 15mm; Case/Package: Radial; REACH SVHC: Yes; Voltage Rating (DC): 50V; Max Operating Temperature: 105°C; Termination: Radial; Weight: 0.102365oz; Series: FR; Impedance: 45mR
J1 J2 = CMP-02766-000581-1: CONN RCPT 4POS 0.1 GOLD PCB; Connector Type: Receptacle; Mating Cycles: 100; Pitch: 2.54mm; Voltage Rating: 550V; Row Spacing: 0.1inch; Number of Positions: 4; Current Rating: 6.9A; Radiation Hardening: No; Color: Black; Number of Rows: 2; Contact Plating: Gold; REACH SVHC: No SVHC; Housing Material: Plastic; Housing Color: Black; Mount: Through Hole; Orientation: Straight; Packaging: Bulk; Lead Free: Lead Free; Gender: Receptacle; Contact Material: Bronze; Termination: Solder; Number of Contacts: 4
J3 = 0022272021: CONN HEADER VERT 2POS 2.54MM; Manufacturer: Molex; Contact Length - Mating: 0.295" (7.49mm); Contact Length - Post: 0.140" (3.56mm); Material Flammability Rating: UL94 V-0; Number of Positions: 2; Number of Positions Loaded: All; Overall Contact Length: 0.560" (14.22mm); Pitch - Mating: 0.100" (2.54mm); Shrouding: Shrouded - 1 Wall; Style: Board to Cable/Wire; Part Number: 0022272021; ComponentLink1Description: Datasheet; ComponentLink1URL: https://www.molex.com/pdm_docs/sd/022272021_sd.pdf; ComponentLink2Description: DigiKey Link; ComponentLink2URL: http://digikey.com/product-detail/en/molex/0022272021/WM4111-ND/1130577; Connector Type: Header; Contact Finish - Mating: Tin; Contact Finish - Post: Tin; Contact Finish Thickness - Mating: 100.0µin (2.54µm); Contact Material: Brass; Contact Shape: Square; Contact Type: Male Pin; Fastening Type: Friction Lock; Insulation Color: Natural; Insulation Height: 0.461" (11.70mm); Insulation Material: Polyamide (PA), Nylon; LastUpdated: 12.01.2020 23:51:43; Lifecycle Status: Active; Minimum Order: 1; Mounting Type: Through Hole; Number of Rows: 1; Packaging: Bulk; PartId: 76; Part Status: Active; Price: 0.27; Series: KK 6410; Supplier 1: DigiKey; Supplier Part Number 1: WM4111-ND; Termination: Solder
L1 = SRP5030T-4R7M: MDA5030-3R3M; Manufacturer: Bourns Inc.; Current Rating (Amps): 4.6 A; Current - Saturation: 6A; DC Resistance (DCR): 53mOhm Max; Inductance: 4.7 µH; Inductance Frequency - Test: 100 kHz; Material - Core: Iron Powder; Shielding: Shielded; Tolerance: ±20%; Type: Drum Core, Wirewound; Part Number: SRP5030T-4R7M; ComponentLink1Description: Datasheet; ComponentLink1URL: https://www.bourns.com/docs/Product-Datasheets/SRP5030T.pdf; ComponentLink2Description: DigiKey Link; ComponentLink2URL: https://www.digikey.com/en/products/detail/bourns-inc/SRP5030T-4R7M/3986084; Device Package: Nonstandard; Height - Seated (Max): 0.118" (3.00mm); LastUpdated: 22.03.2023 20:00:38; Lifecycle Status: Active; Minimum Order: 1; Mounting Type: Surface Mount; Operating Temperature: -40°C ~ 125°C; Package / Case: Nonstandard; Packaging: TapeAndReel; PartId: 1; Part Status: Active; Price: 0.61; Series: SRP5030T; Size / Dimension: 0.224" L x 0.205" W (5.70mm x 5.20mm); Supplier 1: DigiKey; Supplier Part Number 1: SRP5030T-4R7MCT-ND; Value: 3.3 µH
R9 R10 = RC0402FR-07110KL: RES 110K OHM 1% 1/16W 0402; Manufacturer: Yageo; Power (Watts): 0.063W, 1/16W; Temperature Coefficient: ±100ppm/°C; Part Number: RC0402FR-07110KL; ComponentLink1Description: Datasheet; ComponentLink1URL: https://www.yageo.com/upload/media/product/productsearch/datasheet/rchip/PYu-RC_Group_51_RoHS_L_10.pdf; ComponentLink2Description: DigiKey Link; ComponentLink2URL: https://www.digikey.com/en/products/detail/yageo/RC0402FR-07110KL/726531; Composition: Thick Film; Device Package: 0402 (1005 Metric); Features: Moisture Resistant; Height - Seated (Max): 0.016" (0.40mm); LastUpdated: 22.03.2023 19:23:12; Lifecycle Status: Active; Minimum Order: 1; Number of Terminations: 2; Operating Temperature: -55°C ~ 155°C; Package / Case: 0402 (1005 Metric); Packaging: CutTape; PartId: 2713; Part Status: Active; Price: 0.01; Series: RC_L; Size / Dimension: 0.039" L x 0.020" W (1.00mm x 0.50mm); Supplier 1: DigiKey; Supplier Part Number 1: 311-110KLRCT-ND; Supplier Device Package: 0402; Tolerance: ±1%
  R9: Value: 56.2 kOhms; Resistance: 56.2 kOhms
  R10: Value: 10 kOhms; Resistance: 10 kOhms
U7 = RT9013-33GB: Linear Voltage Regulator IC 1 Output 500mA SOT-23-5; MF: Richtek USA; Availability: Unavailable; Price: None; SnapEDA_Link: https://www.snapeda.com/parts/RT9013-33GB/Richtek%20USA%20Inc./view-part/553199/?ref=snap; Value: *; MP: RT9013-33GB; Package: SOT-23-5 Richtek
XF1 = CMP-1502-00236-1: Manufacturer: Wurth Elektronik; Fuse Size: 5x20mm; Mounting Technology: THT; Part Number: 696107003002; Package Reference: 696107003002; Publisher: WurthElektronik; Datasheet URL: https://katalog.we-online.de/em/datasheet/696107003002.pdf; Manufacturer URL: http://www.we-online.de; Operating Temperature: -30to120degC; Packaging: Box

## Nets that join several sheets
+3.3: Nixie_1 (8 pins), Nixie_2 (8 pins), Nixie_3 (8 pins), Nixie_4 (8 pins), STM32 (12 pins), Power (C23.2 U7.5)
+5: Nixie_1 (6 pins), Nixie_2 (6 pins), Nixie_3 (6 pins), Nixie_4 (6 pins), Power (7 pins)
GND: Nixie_1 (C9.1 U2.12), Nixie_2 (C10.1 U3.12), Nixie_3 (C11.1 U4.12), Nixie_4 (C12.1 U5.12), STM32 (24 pins), Power (17 pins)
HV: Nixie_1 (R2.1), Nixie_2 (R3.1), Nixie_3 (R4.1), Nixie_4 (R5.1), Power (J1.1 J1.3)
NetQ1_1: Nixie_1 (Q1.1 RN1.5), STM32 (U1.40)
NetQ1_4: Nixie_1 (Q1.4 RN1.6), STM32 (U1.41)
NetQ2_1: Nixie_1 (Q2.1 RN2.5), STM32 (U1.42)
NetQ2_4: Nixie_1 (Q2.4 RN2.6), STM32 (U1.43)
NetQ3_1: Nixie_2 (Q3.1 RN3.5), STM32 (U1.30)
NetQ3_4: Nixie_2 (Q3.4 RN3.6), STM32 (U1.31)
NetQ4_1: Nixie_2 (Q4.1 RN4.5), STM32 (U1.32)
NetQ4_4: Nixie_2 (Q4.4 RN4.6), STM32 (U1.33)
NetQ5_1: Nixie_3 (Q5.1 RN5.5), STM32 (U1.15)
NetQ5_4: Nixie_3 (Q5.4 RN5.6), STM32 (U1.16)
NetQ6_1: Nixie_3 (Q6.1 RN6.5), STM32 (U1.17)
NetQ6_4: Nixie_3 (Q6.4 RN6.6), STM32 (U1.18)
NetQ7_1: Nixie_4 (Q7.1 RN7.5), STM32 (U1.19)
NetQ7_4: Nixie_4 (Q7.4 RN7.6), STM32 (U1.20)
NetQ8_1: Nixie_4 (Q8.1 RN8.5), STM32 (U1.21)
NetQ8_4: Nixie_4 (Q8.4 RN8.6), STM32 (U1.25)